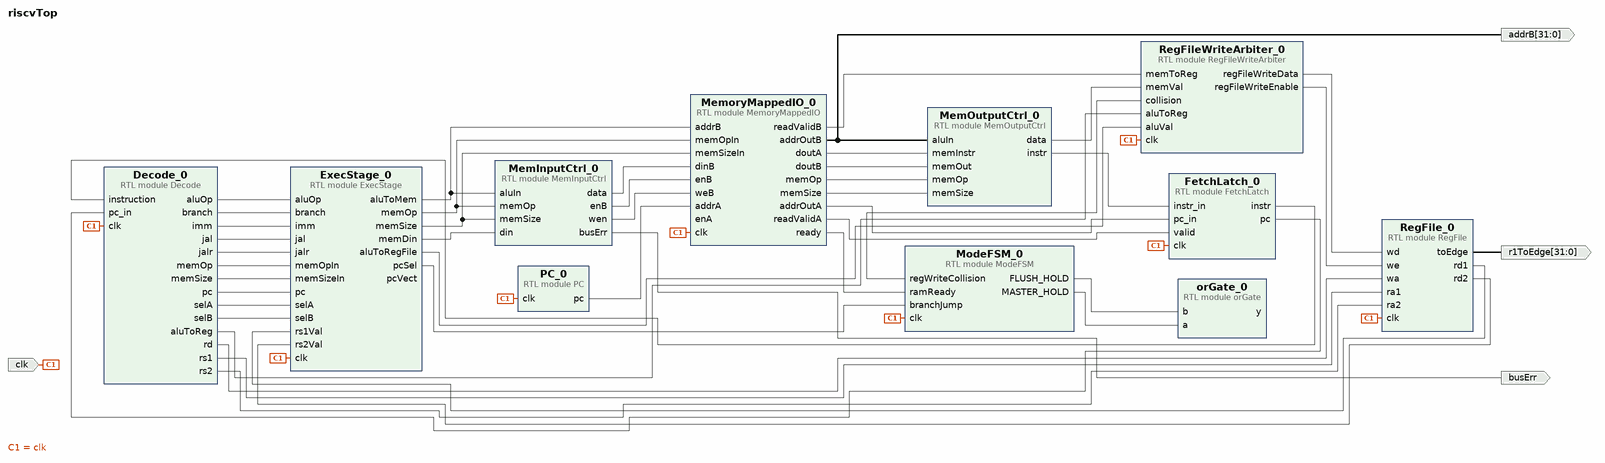
[diagram p0: block diagram of the top level]
# Vivado block design riscvTop, xc7z007sclg400-1, Vivado 2023.1
create_bd_design riscvTop

create_bd_port -dir O busErr
create_bd_port -dir O -from 31 -to 0 r1ToEdge
create_bd_port -dir O -from 31 -to 0 addrB
create_bd_port -dir I -type clk clk
set_property -dict {CONFIG.FREQ_HZ 1000000} [get_bd_ports clk]

create_bd_cell -type module -reference RegFileWriteArbiter RegFileWriteArbiter_0
create_bd_cell -type module -reference orGate orGate_0
create_bd_cell -type module -reference MemInputCtrl MemInputCtrl_0
create_bd_cell -type module -reference MemOutputCtrl MemOutputCtrl_0
create_bd_cell -type module -reference ModeFSM ModeFSM_0
create_bd_cell -type module -reference FetchLatch FetchLatch_0
create_bd_cell -type module -reference MemoryMappedIO MemoryMappedIO_0
create_bd_cell -type module -reference ExecStage ExecStage_0
create_bd_cell -type module -reference PC PC_0
create_bd_cell -type module -reference Decode Decode_0
create_bd_cell -type module -reference RegFile RegFile_0

# ---- connections ----

connect_bd_net [get_bd_pins Decode_0/aluOp] [get_bd_pins ExecStage_0/aluOp]
connect_bd_net [get_bd_pins Decode_0/aluToReg] [get_bd_pins RegFileWriteArbiter_0/aluToReg]
connect_bd_net [get_bd_pins Decode_0/branch] [get_bd_pins ExecStage_0/branch]
connect_bd_net [get_bd_pins Decode_0/imm] [get_bd_pins ExecStage_0/imm]
connect_bd_net [get_bd_pins Decode_0/jal] [get_bd_pins ExecStage_0/jal]
connect_bd_net [get_bd_pins Decode_0/jalr] [get_bd_pins ExecStage_0/jalr]
connect_bd_net [get_bd_pins Decode_0/memOp] [get_bd_pins ExecStage_0/memOpIn]
connect_bd_net [get_bd_pins Decode_0/memSize] [get_bd_pins ExecStage_0/memSizeIn]
connect_bd_net [get_bd_pins Decode_0/pc] [get_bd_pins ExecStage_0/pc]
connect_bd_net [get_bd_pins Decode_0/rd] [get_bd_pins RegFile_0/wa]
connect_bd_net -net Decode_0_regWriteCollision [get_bd_pins RegFileWriteArbiter_0/collision] [get_bd_pins ModeFSM_0/regWriteCollision]
connect_bd_net [get_bd_pins Decode_0/rs1] [get_bd_pins RegFile_0/ra1]
connect_bd_net [get_bd_pins Decode_0/rs2] [get_bd_pins RegFile_0/ra2]
connect_bd_net [get_bd_pins Decode_0/selA] [get_bd_pins ExecStage_0/selA]
connect_bd_net [get_bd_pins Decode_0/selB] [get_bd_pins ExecStage_0/selB]
connect_bd_net [get_bd_pins ExecStage_0/aluToMem] [get_bd_pins MemInputCtrl_0/aluIn] [get_bd_pins MemoryMappedIO_0/addrB]
connect_bd_net [get_bd_pins ExecStage_0/aluToRegFile] [get_bd_pins RegFileWriteArbiter_0/aluVal]
connect_bd_net [get_bd_pins ExecStage_0/memDin] [get_bd_pins MemInputCtrl_0/din]
connect_bd_net [get_bd_pins ExecStage_0/memOp] [get_bd_pins MemInputCtrl_0/memOp] [get_bd_pins MemoryMappedIO_0/memOpIn]
connect_bd_net [get_bd_pins ExecStage_0/memSize] [get_bd_pins MemInputCtrl_0/memSize] [get_bd_pins MemoryMappedIO_0/memSizeIn]
connect_bd_net [get_bd_pins ExecStage_0/pcSel] [get_bd_pins ModeFSM_0/branchJump]
# net ExecStage_0_pcVect has one end: ExecStage_0/pcVect
connect_bd_net [get_bd_pins FetchLatch_0/instr] [get_bd_pins Decode_0/instruction]
connect_bd_net [get_bd_pins FetchLatch_0/pc] [get_bd_pins Decode_0/pc_in]
connect_bd_net [get_bd_pins MemInputCtrl_0/busErr] [get_bd_ports busErr]
connect_bd_net [get_bd_pins MemInputCtrl_0/data] [get_bd_pins MemoryMappedIO_0/dinB]
connect_bd_net [get_bd_pins MemInputCtrl_0/enB] [get_bd_pins MemoryMappedIO_0/enB]
connect_bd_net [get_bd_pins MemInputCtrl_0/wen] [get_bd_pins MemoryMappedIO_0/weB]
connect_bd_net [get_bd_pins MemOutputCtrl_0/data] [get_bd_pins RegFileWriteArbiter_0/memVal]
connect_bd_net [get_bd_pins MemOutputCtrl_0/instr] [get_bd_pins FetchLatch_0/instr_in]
connect_bd_net [get_bd_pins MemoryMappedIO_0/addrOutA] [get_bd_pins FetchLatch_0/pc_in]
connect_bd_net [get_bd_pins MemoryMappedIO_0/addrOutB] [get_bd_pins MemOutputCtrl_0/aluIn] [get_bd_ports addrB]
connect_bd_net [get_bd_pins MemoryMappedIO_0/doutA] [get_bd_pins MemOutputCtrl_0/memInstr]
connect_bd_net [get_bd_pins MemoryMappedIO_0/doutB] [get_bd_pins MemOutputCtrl_0/memOut]
connect_bd_net [get_bd_pins MemoryMappedIO_0/memOp] [get_bd_pins MemOutputCtrl_0/memOp]
connect_bd_net [get_bd_pins MemoryMappedIO_0/memSize] [get_bd_pins MemOutputCtrl_0/memSize]
connect_bd_net [get_bd_pins MemoryMappedIO_0/readValidA] [get_bd_pins FetchLatch_0/valid]
connect_bd_net [get_bd_pins MemoryMappedIO_0/readValidB] [get_bd_pins RegFileWriteArbiter_0/memToReg]
connect_bd_net [get_bd_pins MemoryMappedIO_0/ready] [get_bd_pins ModeFSM_0/ramReady]
connect_bd_net [get_bd_pins ModeFSM_0/FLUSH_HOLD] [get_bd_pins orGate_0/b]
connect_bd_net [get_bd_pins ModeFSM_0/MASTER_HOLD] [get_bd_pins orGate_0/a]
# net PC_0_ena has one end: MemoryMappedIO_0/enA
connect_bd_net [get_bd_pins PC_0/pc] [get_bd_pins MemoryMappedIO_0/addrA]
connect_bd_net [get_bd_pins RegFileWriteArbiter_0/regFileWriteData] [get_bd_pins RegFile_0/wd]
connect_bd_net [get_bd_pins RegFileWriteArbiter_0/regFileWriteEnable] [get_bd_pins RegFile_0/we]
connect_bd_net [get_bd_pins RegFile_0/rd1] [get_bd_pins ExecStage_0/rs1Val]
connect_bd_net [get_bd_pins RegFile_0/rd2] [get_bd_pins ExecStage_0/rs2Val]
connect_bd_net [get_bd_pins RegFile_0/toEdge] [get_bd_ports r1ToEdge]
connect_bd_net [get_bd_ports clk] \
  [get_bd_pins RegFileWriteArbiter_0/clk] [get_bd_pins ModeFSM_0/clk] [get_bd_pins FetchLatch_0/clk] \
  [get_bd_pins MemoryMappedIO_0/clk] [get_bd_pins ExecStage_0/clk] [get_bd_pins PC_0/clk] [get_bd_pins Decode_0/clk] \
  [get_bd_pins RegFile_0/clk]
# net orGate_0_y has one end: orGate_0/y

validate_bd_design
save_bd_design
